# EAGLE design USB-CAN_v0.1 (EAGLE 9.6.2)
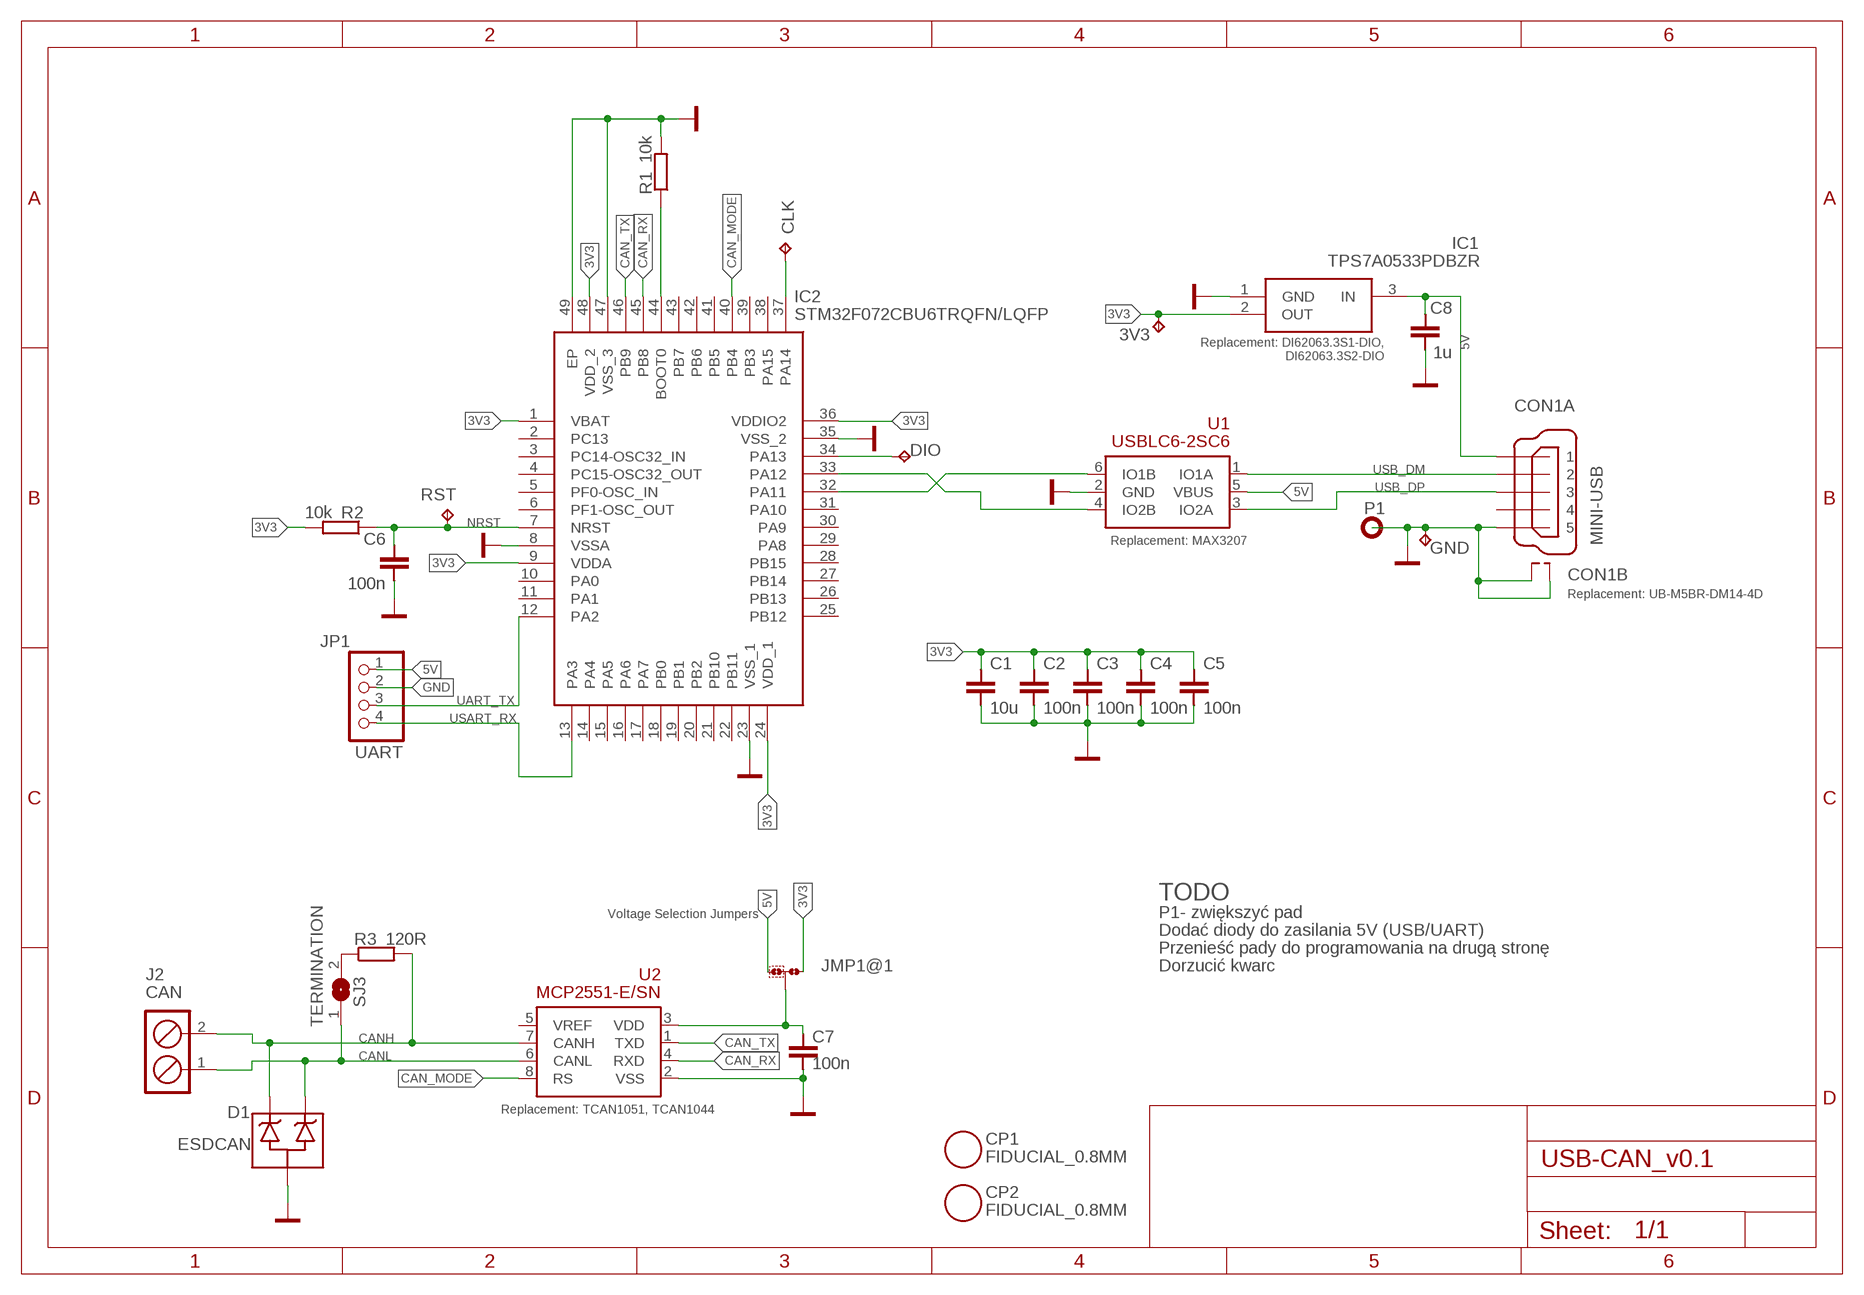
[diagram p0: schematic, sheet 1]

## Parts
3V3  TPTP14R  [TP14R]
C1  10u  CAP_H-0603  [0603]
C2  100n  CAP_H-0603  [0603]
C3  100n  CAP_H-0603  [0603]
C4  100n  CAP_H-0603  [0603]
C5  100n  CAP_H-0603  [0603]
C6  100n  CAP_H-0603  [0603]
C7  100n  CAP_H-0603  [0603]
C8  1u  CAP_H-0603  [0603]
CLK  TPTP14R  [TP14R]
CON1  MINI-USB  [GMSB0522132EU]
CP1  FIDUCIAL_0.8MM  [FIDUCIAL_0.8MM_MINI]
CP2  FIDUCIAL_0.8MM  [FIDUCIAL_0.8MM_MINI]
D1  ESDCAN  TRANSIL-DUO  [SOT323-3L_ST]
DIO  TPTP14R  [TP14R]
GND  TPTP14R  [TP14R]
IC1  TPS7A0533PDBZR  [SOT23]
IC2  STM32F072CBU6TRQFN/LQFP  [LQFP/QFN48]
J2  CAN  SRUB_2PIN  [SRUB_2PIN_5MM]
JMP1  0R-JUMPC  [C0R-JMP]
JP1  UART  PINHD-1X4  [1X04]
P1  PAD1.3  [1,5/0,9]
R1  10k  RES_H-0603  [0603]
R2  10k  RES_H-0603  [0603]
R3  120R  RES_H-0603  [0603]
RST  TPTP14R  [TP14R]
SJ3  TERMINATION  SJ  [SJ]
U1  USBLC6-2SC6  [SOT23-6L]
U2  MCP2551-E/SN  [SO8]

## Nets
3V3: 3V3.TP C1.1 C2.1 C3.1 C4.1 C5.1 IC1.2(OUT) IC2.1(VBAT) IC2.9(VDDA) IC2.24(VDD_1) IC2.36(VDDIO2) IC2.48(VDD_2) JMP1.1 R2.2
5V: C8.1 CON1.P1 IC1.3(IN) JMP1.3 JP1.1 U1.5(VBUS)
CAN_MODE: IC2.40(PB4) U2.8(RS)
CAN_RX: IC2.45(PB8) U2.4(RXD)
CAN_TX: IC2.46(PB9) U2.1(TXD)
CANH: D1.2 J2.2 R3.2 U2.7(CANH)
CANL: D1.1 J2.1 SJ3.1 U2.6(CANL)
GND: C1.2 C2.2 C3.2 C4.2 C5.2 C6.2 C7.2 C8.2 CON1.MH1(B:S1) CON1.MH2(B:S2) CON1.P5 D1.3 GND.TP IC1.1(GND) IC2.8(VSSA) IC2.23(VSS_1) IC2.35(VSS_2) IC2.47(VSS_3) IC2.49(EP) JP1.2 P1.1(P) R1.2 U1.2(GND) U2.2(VSS)
N$1: IC2.44(BOOT0) R1.1
N$2: DIO.TP IC2.34(PA13)
N$3: CLK.TP IC2.37(PA14)
N$4: IC2.32(PA11) U1.6(IO1B)
N$5: R3.1 SJ3.2
N$9: IC2.33(PA12) U1.4(IO2B)
NRST: C6.1 IC2.7(NRST) R2.1 RST.TP
UART_TX: IC2.12(PA2) JP1.3
USART_RX: IC2.13(PA3) JP1.4
USB_DM: CON1.P2 U1.1(IO1A)
USB_DP: CON1.P3 U1.3(IO2A)
XCR_PWR: C7.1 JMP1.2 U2.3(VDD)
Unconnected: CON1.P4 IC2.2(PC13) IC2.3(PC14-OSC32_IN) IC2.4(PC15-OSC32_OUT) IC2.5(PF0-OSC_IN) IC2.6(PF1-OSC_OUT) IC2.10(PA0) IC2.11(PA1) IC2.14(PA4) IC2.15(PA5) IC2.16(PA6) IC2.17(PA7) IC2.18(PB0) IC2.19(PB1) IC2.20(PB2) IC2.21(PB10) IC2.22(PB11) IC2.25(PB12) IC2.26(PB13) IC2.27(PB14) IC2.28(PB15) IC2.29(PA8) IC2.30(PA9) IC2.31(PA10) IC2.38(PA15) IC2.39(PB3) IC2.41(PB5) IC2.42(PB6) IC2.43(PB7) U2.5(VREF)

## Notes on the sheet
- Replacement: DI62063.3S1-DIO,
  DI62063.3S2-DIO
- Replacement: MAX3207
- Replacement: UB-M5BR-DM14-4D
- TODO
- Voltage Selection Jumpers | P1- zwiększyć pad
- Dodać diody do zasilania 5V (USB/UART)
- Przenieść pady do programowania na drugą stronę
- Dorzucić kwarc
- Replacement: TCAN1051, TCAN1044

## Library data of the parts
3V3 CLK DIO GND RST = hsrn_pads+holes:TP: Test pad
C1-C8 = hsrn_rcl:CAP_H
CON1 = hsrn_zlacza:MINI-USB: MINI USB-B R/A W/O POST 5 pol. Source: www.cypressindustries.com
CP1 CP2 = hsrn_pads+holes:FIDUCIAL: For use by pick and place machines to calibrate the vision/machine, 1mm By microbuilder.eu
D1 = hsrn_diody:TRANSIL-DUO
IC1 = hsrn_IC_power_mgmt:TPS7A0533P: 1-A, ultra-low-IQ, 200-mA low-dropout (LDO) regulator in a small-sized package Source: Datasheet <https://www.ti.com/lit/gpn/TPS7A05>
IC2 = SamacSys_Parts:STM32F072CBU6TR: MCU 32-bit ARM Cortex M0 RISC 128KB Flash 2.5V/3.3V 48-Pin UFQFPN EP T/R Source: Datasheet <https://www.arrow.com/en/products/stm32f072cbu6tr/stmicroelectronics>
J2 = hsrn_zlacza:SRUB_2PIN: MKDSN 1,5/ 2-5,08 Printklemme Nennstrom: 13,5 A Nennspannung: 250 V Rastermaß: 5,08 mm Polzahl: 2 Anschlussart: Schraubanschluss Montage: Löten Anschlussrichtung Leiter/Platine: 0 ° Artikelnummer: 1729128 Source: http://eshop.phoenixcontact.com .. 1729128.pdf; MPN: MKDSN 1,5/2-5.08; OC_FARNELL: 1792903; OC_NEWARK: 30M2397
JMP1 = hsrn_switche:0R-JUMP: SMD 0R 0805 Jumper
JP1 = pinhead:PINHD-1X4: PIN HEADER
P1 = hsrn_pads+holes:PAD
R1-R3 = hsrn_rcl:RES_H
SJ3 = hsrn_inne:SJ: SMD solder JUMPER
U1 = hsrn_IC:USBLC6-2
U2 = hsrn_IC:MCP2551

## Board
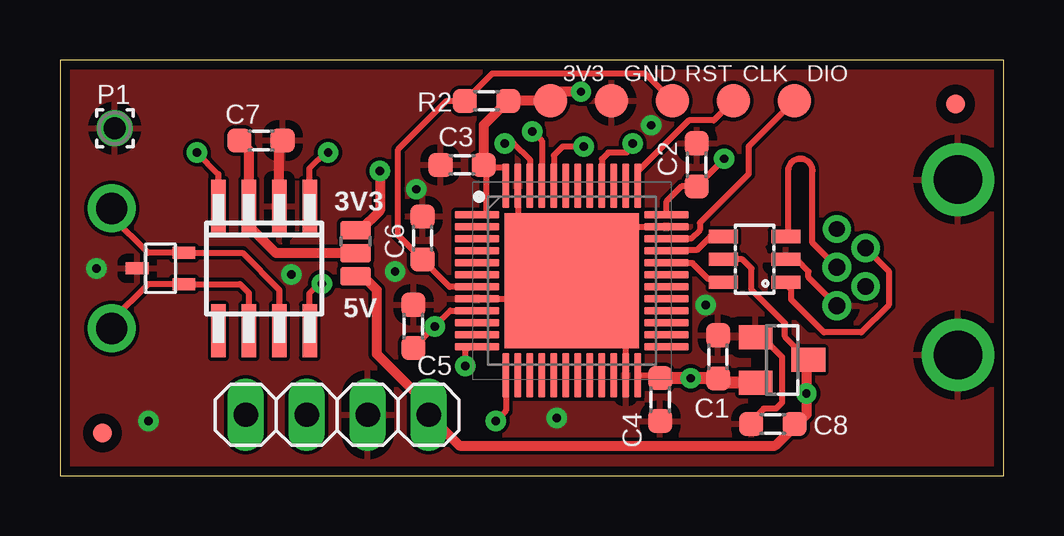
[diagram p1: board, top side]
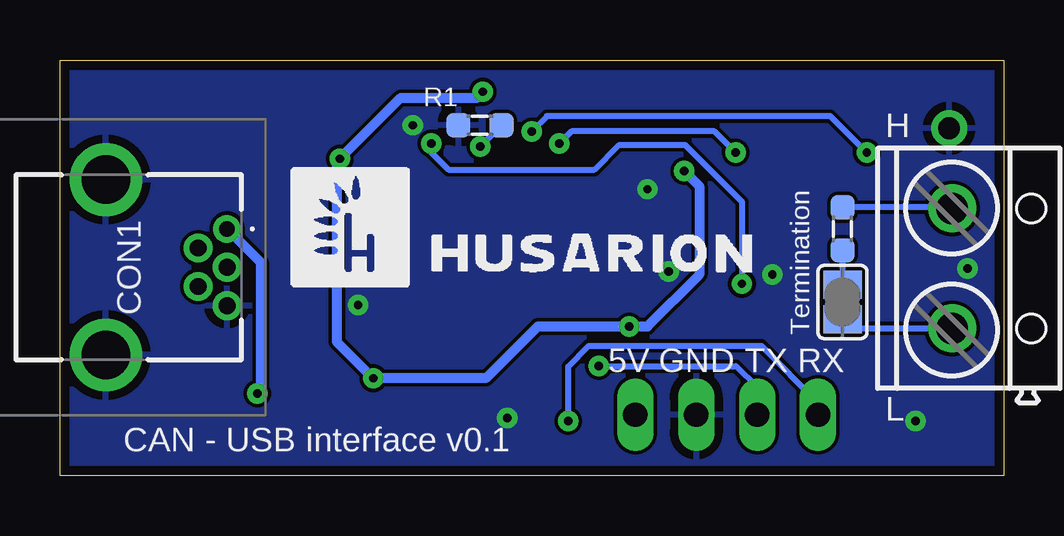
[diagram p2: board, bottom side, seen from below]

Size 39.35 x 17.32 mm. Coordinates in mm from the lower left corner, seen from the top.
Outline: 0,0 39.35,0 39.35,17.32 0,17.32 0,0
Copper layers (1*16): Top 0.035mm / dielectric 1.45mm / Bottom 0.035mm
Design rules "hsrn_2-layer-35um-cost-effective *": minimum track width 0.2mm, minimum drill 0.35mm, track to track 0.15mm, track to pad 0.15mm, pad to pad 0.15mm, via to via 0.2mm, smd to smd 0.15mm, copper to edge 0.4mm, drill to drill 0.3mm, minimum pad ring 0.25mm, minimum via ring 0.25mm, stop-mask expansion 0.1mm, vias tented up to drill 0.4mm, thermal gap 0.35mm

### Footprints (pad centres in the part's own frame; a part is rotated, then mirrored left to right if it is on the bottom)
TP14R = smd 1.4 x 1.4: TP 0,0
0603 = smd 1 x 1: 1 -0.9,0; 2 0.9,0
GMSB0522132EU = drill 2.02 pad 3.03: MH1 -2.05,-5.05; MH2 5.25,-5.05 | drill 0.65 pad 1.1: P1 0,0 | drill 0.7 pad 1.1: P2 0.8,-1.2 | drill 0.7 pad 1.2: P3 1.6,0; P4 2.4,-1.2; P5 3.2,0
FIDUCIAL_0.8MM_MINI = smd 0.8 x 0.8: 1 0,0
SOT323-3L_ST = smd 0.5 x 0.95: 1 -0.65,-0.975; 2 0.65,-0.975; 3 0,0.975
SOT23 = smd 1 x 1.4: 1 -0.95,-1.1; 2 0.95,-1.1; 3 0,1.1
LQFP/QFN48 = smd 1.85 x 0.3: 1 -3.95,2.75; 2 -3.95,2.25; 3 -3.95,1.75; 4 -3.95,1.25; 5 -3.95,0.75; 6 -3.95,0.25; 7 -3.95,-0.25; 8 -3.95,-0.75; 9 -3.95,-1.25; 10 -3.95,-1.75; 11 -3.95,-2.25; 12 -3.95,-2.75; 25 3.95,-2.75; 26 3.95,-2.25; 27 3.95,-1.75; 28 3.95,-1.25; 29 3.95,-0.75; 30 3.95,-0.25; 31 3.95,0.25; 32 3.95,0.75; 33 3.95,1.25; 34 3.95,1.75; 35 3.95,2.25; 36 3.95,2.75 | smd 0.3 x 1.85: 13 -2.75,-3.95; 14 -2.25,-3.95; 15 -1.75,-3.95; 16 -1.25,-3.95; 17 -0.75,-3.95; 18 -0.25,-3.95; 19 0.25,-3.95; 20 0.75,-3.95; 21 1.25,-3.95; 22 1.75,-3.95; 23 2.25,-3.95; 24 2.75,-3.95; 37 2.75,3.95; 38 2.25,3.95; 39 1.75,3.95; 40 1.25,3.95; 41 0.75,3.95; 42 0.25,3.95; 43 -0.25,3.95; 44 -0.75,3.95; 45 -1.25,3.95; 46 -1.75,3.95; 47 -2.25,3.95; 48 -2.75,3.95 | smd 5.613 x 5.613: 49 0,0
SRUB_2PIN_5MM = drill 1.3 pad 2: 1 -2.5,0; 2 2.5,0
C0R-JMP = smd 1.27 x 0.762: 1 0,0.953; 2 0,0; 3 0,-0.953
1X04 = drill 1.016 long: 1 -3.81,0; 2 -1.27,0; 3 1.27,0; 4 3.81,0
1,5/0,9 = drill 0.91 pad 1.5: 1 0,0
SJ = smd 1.168 x 1.6: 1 -0.711,0; 2 0.711,0
SOT23-6L = smd 0.55 x 1.2: 1 -0.95,-1.3; 2 0,-1.3; 3 0.95,-1.3; 4 0.95,1.3; 5 0,1.3; 6 -0.95,1.3
SO8 = smd 0.6 x 2.2: 1 -1.905,-2.6; 2 -0.635,-2.6; 3 0.635,-2.6; 4 1.905,-2.6; 5 1.905,2.6; 6 0.635,2.6; 7 -0.635,2.6; 8 -1.905,2.6

### Placement (x,y rotation side)
3V3  20.45,15.62 0 top
C1  27.43,4.95 90 top
C2  26.54,12.95 90 top
C3  16.76,12.95 180 top
C4  25.02,3.17 270 top
C5  14.73,6.22 90 top
C6  15.11,9.91 90 top
C7  8.38,13.97 0 top
C8  29.72,2.16 180 top
CLK  28.07,15.62 0 top
CON1  32.38,10.29 270 bottom
CP1  1.78,1.78 0 top
CP2  37.34,15.49 0 top
D1  4.19,8.64 90 top
DIO  30.61,15.62 0 top
GND  22.99,15.62 0 top
IC1  30.1,4.83 270 top
IC2  21.34,8.13 0 top
J2  2.16,8.64 90 bottom
JMP1  12.32,9.27 0 top
JP1  11.56,2.54 180 top
P1  2.29,14.48 0 top
R1  21.84,14.61 180 bottom
R2  17.78,15.62 0 top
R3  6.73,10.29 90 bottom
RST  25.53,15.62 0 top
SJ3  6.73,7.24 90 bottom
U1  28.96,9.02 90 top
U2  8.51,8.64 180 top
U$2  [HUS_NAPIS_BOK_5MM]  29.72,7.87 0 bottom

### Tracks (layer width: path | path; a pad name or v marks a point on that pad's centre or on a via)
3V3  (via drill 0.35)
  Top 0.254: v27.69,13.21 v27.69,13.2 C2.1 25.91,12.05 25.29,11.43 IC2.36 | C5.1 15.62,6.21 v15.62,6.22 16.28,6.88 IC2.9 | IC2.48 18.59,12.83 17.79,12.83 C3.1 17.76,12.86 17.76,10.88 IC2.1 | IC2.24 24.92,4.18 25.03,4.06
  Top 0.406: v21.72,16 20.83,16 3V3.TP R2.2 17.66,14.61 C3.1 | JMP1.1 12.51,10.22 13.33,11.05 v13.33,12.7
  Top 0.508: IC1.2 27.61,3.88 C1.1 26.3,4.05 v26.29,4.06 25.03,4.06 C4.1
  Bottom 0.406: v21.72,16 21.97,15.75 25.15,15.75 v27.69,13.21 27.81,13.08 27.81,5.59 v26.29,4.06 21.59,4.06 19.43,6.22 v15.62,6.22 14.86,6.22 12.7,8.38 12.7,12.07 v13.33,12.7
5V  (via drill 0.35)
  Top 0.254: U1.5 28.45,9.02 28.83,8.64 28.83,7.75 30.23,6.35 30.23,5.8 IC1.3
  Top 0.406: C8.1 30.62,2.05 | 30.62,2.05 29.82,1.25 16.65,1.25 JP1.1 15.37,2.92 13.21,5.08 13.21,7.75 12.64,8.32 JMP1.3 | IC1.3 31.12,4.74 v31.12,3.43 31.12,2.55 30.62,2.05
  Bottom 0.406: v31.12,3.43 30.99,3.56 30.99,8.89 CON1.P1
CAN_MODE  (via drill 0.35)
  Top 0.254: U2.8 10.41,7.62 10.79,8 v10.92,8 | v23.88,13.84 23.88,13.72 23.62,13.46 22.86,13.46 22.59,13.19 IC2.40
  Bottom 0.254: v23.88,13.84 23.88,13.48 23.15,12.75 17.08,12.75 16.04,13.79 13.3,13.79 10.92,11.42 v10.92,8
CAN_RX  (via drill 0.35)
  Top 0.254: v5.71,13.46 6.6,12.57 U2.4 | v19.69,14.35 20.09,13.95 IC2.45
  Bottom 0.254: v5.71,13.46 7.24,14.99 19.05,14.99 v19.69,14.35
CAN_TX  (via drill 0.35)
  Top 0.254: U2.1 10.41,12.83 11.05,13.46 v11.18,13.46 | v18.54,13.84 18.92,13.84 19.59,13.18 IC2.46
  Bottom 0.254: v11.18,13.46 12.06,14.35 18.03,14.35 v18.54,13.84
CANH
  Top 0.254: J2.2 2.16,10.79 3.67,9.29 D1.2 7.61,9.29 9.14,7.75 U2.7
  Bottom 0.254: J2.2 2.21,11.19 R3.2
CANL
  Top 0.254: J2.1 2.16,6.48 3.67,7.99 D1.1 7.51,7.99 7.87,7.62 U2.6
  Bottom 0.254: J2.1 6.35,6.15 SJ3.1
GND  (via drill 0.35)
  Top 0.254: IC2.47 19.09,10.38 IC2.49 | IC2.8 20.59,7.38 IC2.49 | IC2.23 23.59,5.88 IC2.49 | IC2.35 24.76,10.36 23.85,10.36 21.62,8.13 IC2.49 | CON1.P5 31.2,8.27 31.2,8.51 30.7,9.02 U1.2 | IC1.1 29.28,5.78 30.1,4.95 30.1,3.05 29.85,2.79 29.34,2.79 28.82,2.27 C8.2
  Top 0.406: U2.2 9.14,13.83 C7.2
  other vias: 24.64,14.61 20.7,2.41 14.86,11.94 3.68,2.29 1.52,8.64 13.97,8.51 9.65,8.38 26.92,7.11
  pour Top (rank 2): 0,17.27 39.12,17.27 39.12,0 -0.13,0 -0.13,17.14
  pour Bottom (rank 2): -0.13,0 -0.13,17.27 39.12,17.27 39.24,0 39.12,0
  pour Top (rank 2, no thermals): 29.59,9.02 29.08,9.02 28.83,9.27 28.83,9.53 28.96,9.65 29.08,9.65 29.34,9.4 29.34,9.27 29.46,9.14 29.59,9.14
N$1  (via drill 0.35)
  Top 0.254: v21.83,13.72 20.96,13.72 20.59,13.35 IC2.44
  Bottom 0.254: R1.1 v21.83,13.72
N$2
  Top 0.254: DIO.TP 28.7,13.72 28.7,12.57 26.67,10.54 26.67,10.24 26.31,9.88 IC2.34
N$3
  Top 0.254: CLK.TP 27.25,14.81 26.21,14.81 24.09,12.68 IC2.37
N$4
  Top 0.254: IC2.32 24.81,8.86 26.37,8.86 27.03,8.19 27.53,8.19 U1.6
N$5
  Bottom 0.254: R3.1 SJ3.2
N$6
  cutout Top (rank 2): 32.89,7.37 32.64,7.62 32.64,8.89 32.26,9.27 30.61,9.27 30.1,8.76 30.1,7.24 31.24,6.1 32.77,6.1 32.89,6.22
N$7
  cutout Top (rank 2): 28.83,5.84 29.59,5.84 30.23,5.21 30.23,2.54 29.72,2.03 29.08,2.03 28.83,2.29 28.83,3.17 28.96,3.3 28.96,5.08 28.58,5.46 28.58,5.59
N$8
  cutout Top (rank 2): 18.42,5.33 18.42,11.05 24.13,11.05 24.13,5.33
N$9
  Top 0.254: IC2.33 24.81,9.4 26.55,9.4 27.11,9.97 U1.4
NRST
  Top 0.254: RST.TP 24.38,16.76 18.02,16.76 R2.1 16.12,15.62 14.1,13.6 14.1,10.02 C6.1 16.25,7.87 17.88,7.87 IC2.7
UART_TX  (via drill 0.35)
  Top 0.254: IC2.12 17.06,5.38 16.89,5.21 v16.89,4.57
  Bottom 0.254: v16.89,4.57 11.18,4.57 10.29,3.68 JP1.3
USART_RX  (via drill 0.35)
  Top 0.254: IC2.13 18.59,2.71 v18.16,2.29
  Bottom 0.254: v18.16,2.29 18.16,4.56 17.31,5.41 10.11,5.41 7.75,3.05 JP1.4
USB_DM
  Top 0.254: CON1.P2 34.54,8.53 34.54,7.11 33.4,5.97 31.85,5.97 30.48,7.33 30.48,7.75 30.26,7.97 U1.1
USB_DP
  Top 0.254: CON1.P3 31.37,9.7 31.37,12.7 arc90 30.86,13.21 arc90 30.35,12.7 30.35,10.06 U1.3
XCR_PWR
  Top 0.406: C7.1 7.87,13.58 U2.3 7.87,10.41 9.02,9.27 JMP1.2

### Text on the board
tNames: 3V3 | 5V
bNames: H | Termination | 5V GND TX RX | L | CAN - USB interface v0.1